# EAGLE design XBeeShield (EAGLE 5.11)
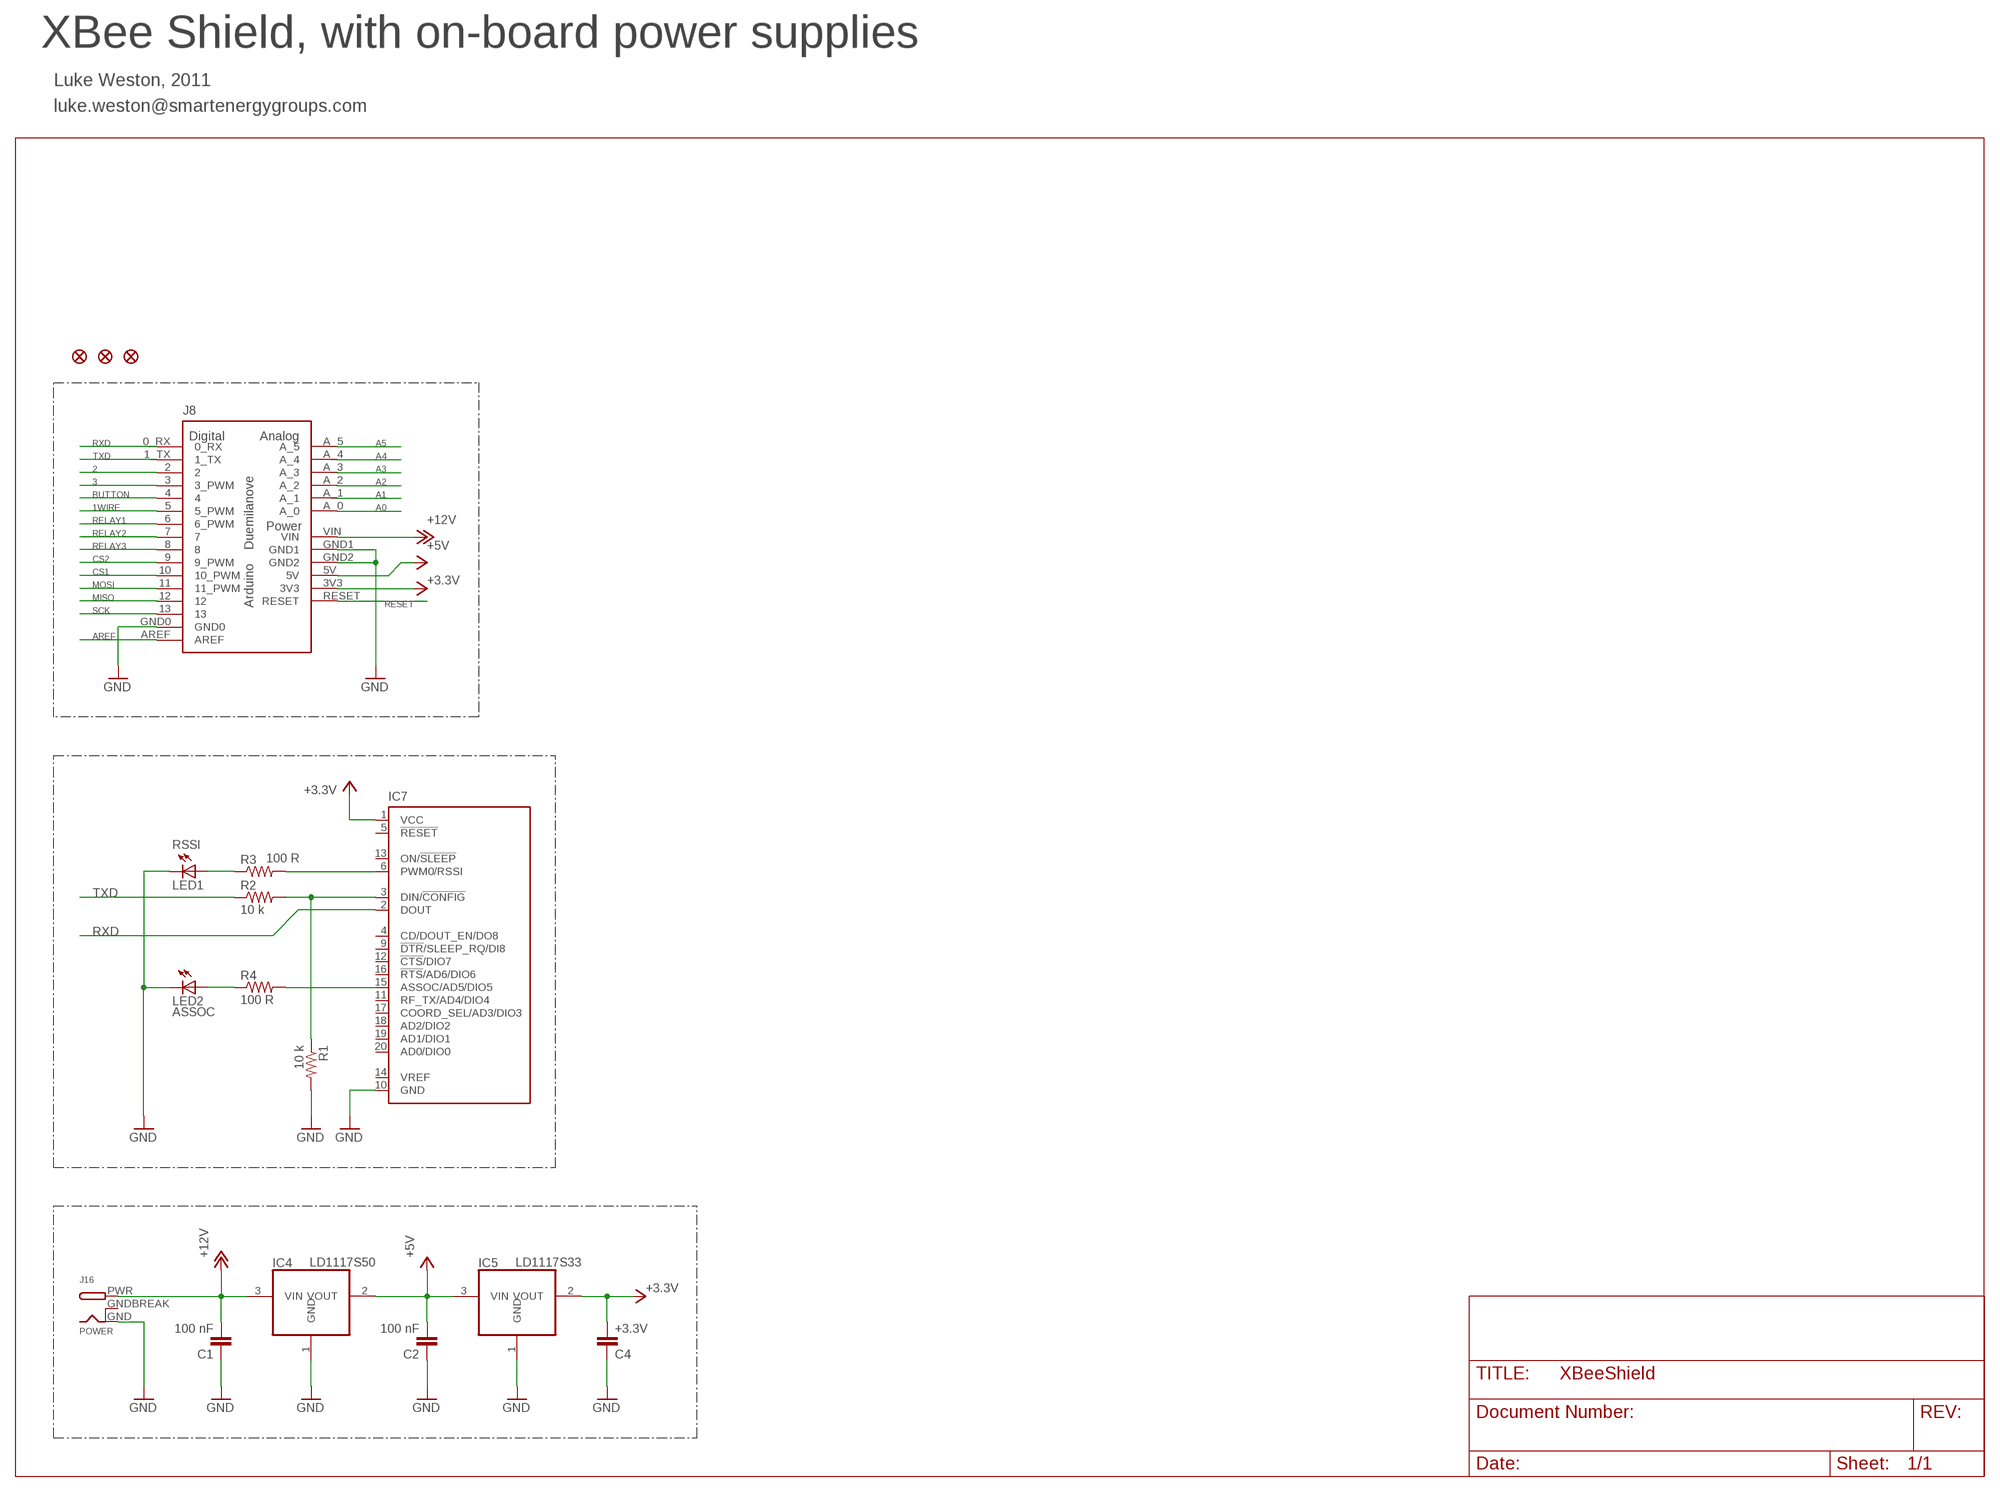
[diagram p0: schematic, sheet 1]

## Parts
C1  100 nF  C-EU050-024X044  [C050-024X044]
C2  100 nF  C-EU050-024X044  [C050-024X044]
C4  +3.3V  C-EU050-024X044  [C050-024X044]
IC4  LD1117S50  REG1117  [SOT223]
IC5  LD1117S33  REG1117  [SOT223]
IC7  XBEE-PRO  [XBEE-PRO]
J8  ARDUINO-USBNO-OUTLINE-NO-TEXT-OCTAGONAL  [NO-OUTLINE-OCTAGONAL-NOTEXT]
J16  POWER  DCBARRELPTH  [DCJACK_2MM_PTH]
JP2  FIDUCIAL1.5X3  [FIDUCIAL-1.5X3]
JP3  FIDUCIAL1.5X3  [FIDUCIAL-1.5X3]
JP4  FIDUCIAL1.5X3  [FIDUCIAL-1.5X3]
LED1  RSSI  LED3MM  [LED3MM]
LED2  ASSOC  LED3MM  [LED3MM]
R1  10 k  R-US_0207/10  [0207/10]
R2  10 k  R-US_0207/10  [0207/10]
R3  100 R  R-US_0207/10  [0207/10]
R4  100 R  R-US_0207/10  [0207/10]

## Nets
1WIRE: J8.5(5_PWM)
2: J8.2
3: J8.3(3_PWM)
+3.3V: C4.2 IC5.2(VOUT) IC7.1(VCC) J8.3V3
+5V: C2.2 IC4.2(VOUT) IC5.3(VIN) J8.5V
+12V: C1.2 IC4.3(VIN) J8.VIN J16.PWR
A0: J8.A_0
A1: J8.A_1
A2: J8.A_2
A3: J8.A_3
A4: J8.A_4
A5: J8.A_5
AREF: J8.AREF
BUTTON: J8.4
CS1: J8.10(10_PWM)
CS2: J8.9(9_PWM)
GND: C1.1 C2.1 C4.1 IC4.1(GND) IC5.1(GND) IC7.10(GND) J8.GND0 J8.GND1 J8.GND2 J16.GND LED1.K(C) LED2.K(C) R1.2
MISO: J8.12
MOSI: J8.11(11_PWM)
N$23: IC7.6(PWM0/RSSI) R3.2
N$25: IC7.3(DIN/!CONFIG) R1.1 R2.2
N$29: IC7.15(ASSOC/AD5/DIO5) R4.2
N$33: LED1.A R3.1
N$34: LED2.A R4.1
RELAY1: J8.6(6_PWM)
RELAY2: J8.7
RELAY3: J8.8
RESET: J8.RESET
RXD: IC7.2(DOUT) J8.0_RX
SCK: J8.13
TXD: J8.1_TX R2.1
Unconnected: IC7.4(CD/DOUT_EN/DO8) IC7.5(!RESET) IC7.9(!DTR!/SLEEP_RQ/DI8) IC7.11(RF_TX/AD4/DIO4) IC7.12(!CTS!/DIO7) IC7.13(ON/!SLEEP) IC7.14(VREF) IC7.16(!RTS!/AD6/DIO6) IC7.17(COORD_SEL/AD3/DIO3) IC7.18(AD2/DIO2) IC7.19(AD1/DIO1) IC7.20(AD0/DIO0)

## Notes on the sheet
- XBee Shield, with on-board power supplies
- Luke Weston, 2011
- luke.weston@smartenergygroups.com

## Power pins joined to a net without a drawn wire
GNDBREAK: J16.GNDBREAK

## Library data of the parts
C1 C2 C4 = rcl:C-EU: CAPACITOR, European symbol
IC4 IC5 = burr-brown:REG1117: 800mA and 1A Low Dropout (LDO) Positive Regulator 1.8V, 2.5V, 2.85V, 3.3V, 5V, and Adj; MPN: REG1117; OC_FARNELL: 1097566; OC_NEWARK: 14P6981
IC7 = maxstream:XBEE: XBee (TM) /XBee-PRO(TM) OEM RF Modules Source: MaxStream, Inc. xbee_productmanual.pdf; MPN: XBP24-AWI-001; OC_FARNELL: 1337916; OC_NEWARK: 42M2667
J8 = Arduino-Various:ARDUINO-USB: The Ardiuno Duemilanove Pinouts layoutet as a Bare Shield. v0.5 Also for Arduino Diecimila. This is designed as a Part and has no Outline in the Dimension Layer. The Outline, when present, is drawed at the tPlace / bPlace Layer. Library by Stephanie Lange, http://www.k-ita.de/~sl/
J16 = adafruit:DCBARREL: 2.0mm DC Barrel Jack DCJACK_2MM_PTH - Through Hole Jack (4UConnector: 05537)
JP2-JP4 = SparkFun:FIDUCIAL: Fiducial Alignment Points Various fiducial points for machine vision alignment.
LED1 LED2 = SparkFun:LED: LEDs Standard schematic elements and footprints for 5mm, 3mm, 1206, and 0603 sized LEDs. 5mm - Spark Fun Electronics SKU : COM-00529 (and others)
R1-R4 = rcl:R-US_: RESISTOR, American symbol

## Board
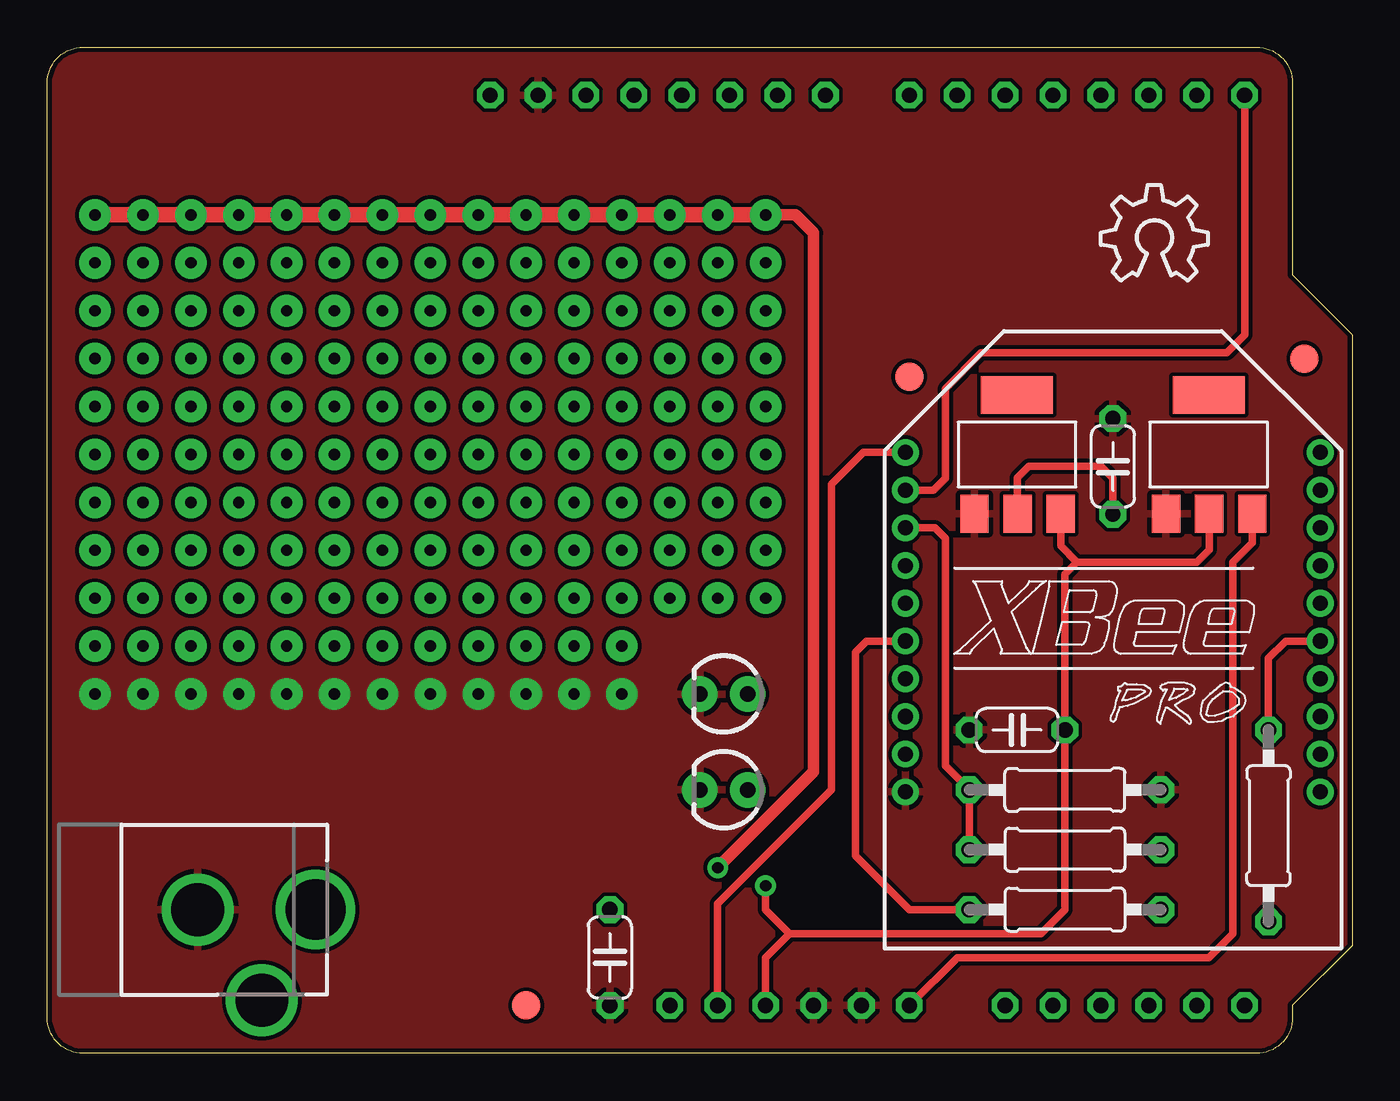
[diagram p1: board, top side]
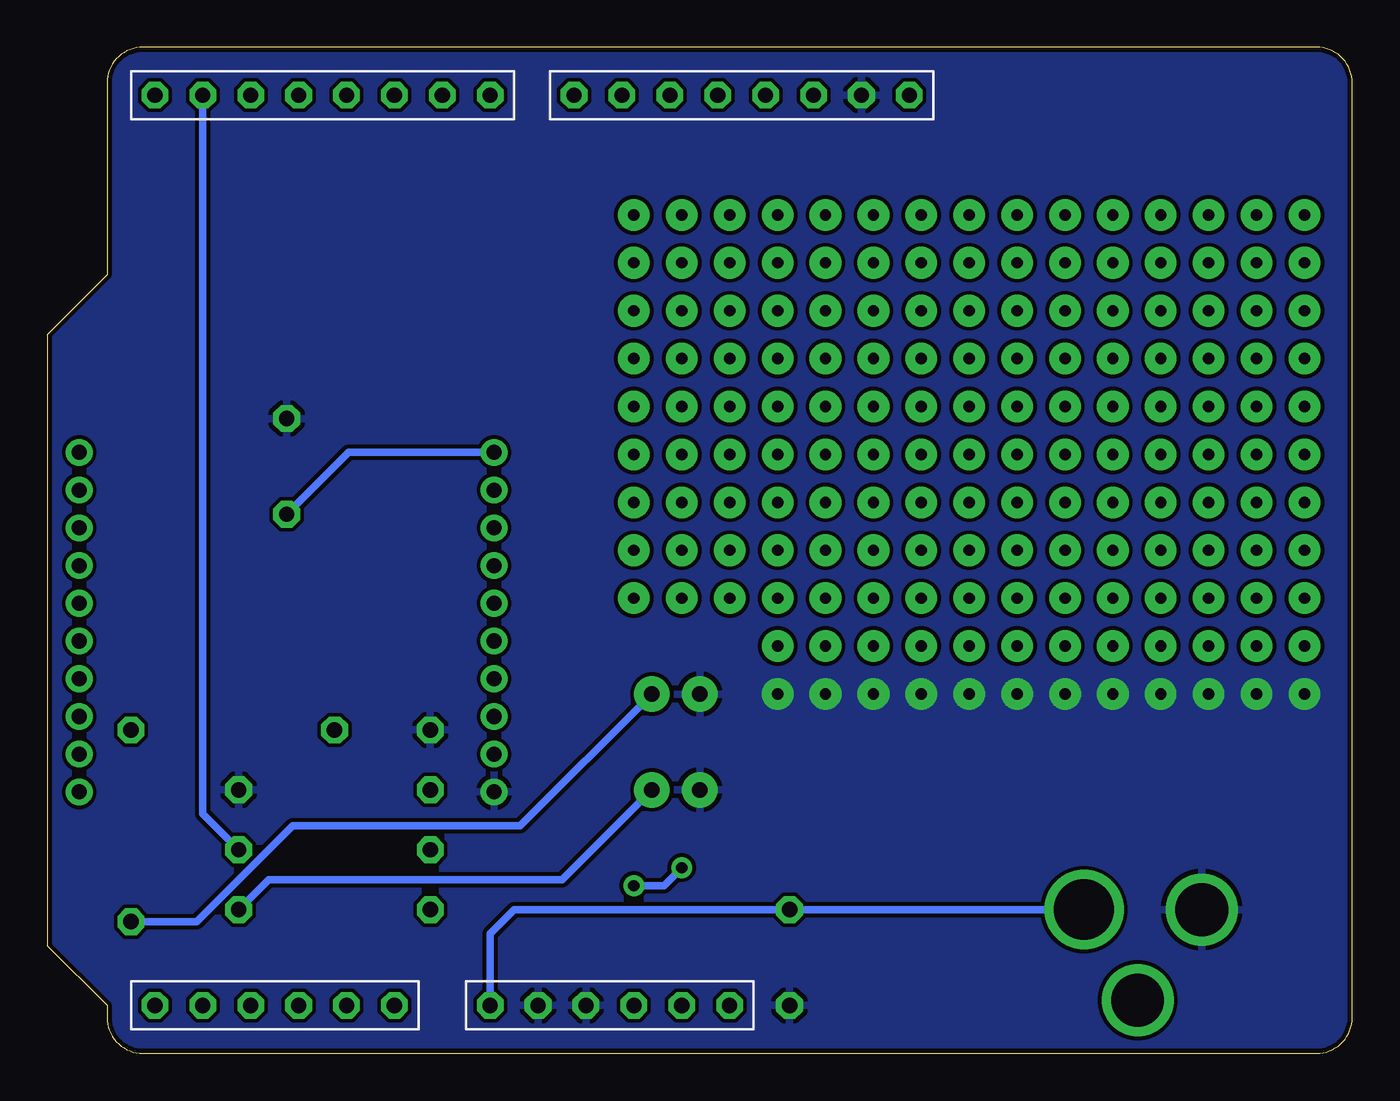
[diagram p2: board, bottom side, seen from below]

Size 69.22 x 53.34 mm. Coordinates in mm from the lower left corner, seen from the top.
Outline: 69.22,5.71 66.04,2.54 66.04,1.9 arc-90 64.14,0 1.91,0 arc-90 0,1.9 0,51.43 arc-90 1.91,53.34 64.14,53.34 arc-90 66.04,51.43 66.04,41.27 69.22,38.1 69.22,5.71
Copper layers (1*16): Top 0.035mm / dielectric 1.5mm / Bottom 0.035mm
Design rules "SparkFun.drc": minimum track width 8mil, minimum drill 20mil, track to track 8mil, track to pad 8mil, pad to pad 8mil, via to via 8mil, smd to smd 8mil, copper to edge 10mil, drill to drill 8mil, minimum pad ring 12mil, minimum via ring 10mil, stop-mask expansion 4mil, vias tented up to drill 25mil, thermal gap 10mil

### Footprints (pad centres in the part's own frame; a part is rotated, then mirrored left to right if it is on the bottom)
C050-024X044 = drill 0.813 octagon: 1 -2.54,0; 2 2.54,0
SOT223 = smd 1.499 x 2.007: 1 -2.261,-3.15; 2 0.025,-3.15; 3 2.311,-3.15 | smd 3.81 x 2.007: 4 0,3.15
XBEE-PRO = drill 0.8 pad 1.27 round: 1 -11,9; 2 -11,7; 3 -11,5; 4 -11,3; 5 -11,1; 6 -11,-1; 7 -11,-3; 8 -11,-5; 9 -11,-7; 10 -11,-9; 11 11,-9; 12 11,-7; 13 11,-5; 14 11,-3; 15 11,-1; 16 11,1; 17 11,3; 18 11,5; 19 11,7; 20 11,9
NO-OUTLINE-OCTAGONAL-NOTEXT = drill 0.8 pad 1.27 octagon: 0_RX -25.4,27.94; 1_TX -25.4,25.4; 2 -25.4,22.86; 3 -25.4,20.32; 3V3 22.86,0; 4 -25.4,17.78; 5 -25.4,15.24; 5V 22.86,2.54; 6 -25.4,12.7; 7 -25.4,10.16; 8 -25.4,5.715; 9 -25.4,3.175; 10 -25.4,0.635; 11 -25.4,-1.905; 12 -25.4,-4.445; 13 -25.4,-6.985; A_0 22.86,15.24; A_1 22.86,17.78; A_2 22.86,20.32; A_3 22.86,22.86; A_4 22.86,25.4; A_5 22.86,27.94; AREF -25.4,-12.065; GND0 -25.4,-9.525; GND1 22.86,7.62; GND2 22.86,5.08; RESET 22.86,-2.54; VIN 22.86,10.16
DCJACK_2MM_PTH = drill 2.8 round: GND 0,7.35; GNDBREAK 4.8,10.75 | drill 3.2 round: PWR 0,13.6
FIDUCIAL-1.5X3 = smd 1.5 x 1.5: 1 0,0
LED3MM = drill 0.813 pad 1.88 round: A -1.27,0; K 1.27,0
0207/10 = drill 0.813 octagon: 1 -5.08,0; 2 5.08,0

### Placement (x,y rotation side)
C1  29.84,5.08 90 top
C2  51.44,17.14 0 top
C4  56.52,31.11 270 top
IC4  61.59,31.75 0 top
IC5  51.44,31.75 0 top
IC7  56.52,22.86 0 top
J8  35.56,25.4 270 top
J16  0.63,7.62 270 top
JP2  66.67,36.83 180 top
JP3  45.72,35.88 180 top
JP4  25.4,2.54 180 top
LED1  35.88,13.97 180 top
LED2  35.88,19.05 180 top
R1  53.98,13.97 0 top
R2  53.98,10.79 180 top
R3  53.98,7.62 180 top
R4  64.77,12.06 90 top
U$1  [OSHW_8X200_NOTEXT]  55.88,40.96 0 top

### Tracks (layer width: path | path; a pad name or v marks a point on that pad's centre or on a via)
+3.3V
  Top 0.406: 51.44,28.63 IC5.2 51.46,30.5 52.07,31.11 55.88,31.11 56.52,30.48 C4.2 | J8.3V3 35.56,7.94 41.59,13.97 41.59,30.16 43.29,31.86 IC7.1
  Bottom 0.406: IC7.1 53.23,31.86 C4.2
+5V  (via drill 0.6, 0.6 pad 1.68)
  Top 0.406: 61.59,28.63 IC4.2 61.62,26.7 60.96,26.04 54.61,26.04 | IC5.3 53.75,26.9 54.61,26.04 | 54.61,26.04 53.98,25.4 C2.2 53.98,7.62 52.7,6.35 39.37,6.35 | J8.5V 38.1,5.08 39.37,6.35 | 39.37,6.35 38.1,7.62 v38.1,8.89
  Top 0.61: v38.1,44.45 39.69,44.45 40.64,43.5 40.64,14.92 v35.56,9.84
  Top 0.813: v2.54,44.45 v5.08,44.45 v7.62,44.45 v10.16,44.45 v12.7,44.45 v15.24,44.45 v17.78,44.45 v20.32,44.45 v22.86,44.45 v25.4,44.45 v27.94,44.45 v30.48,44.45 v33.02,44.45 v35.56,44.45 v38.1,44.45
  Bottom 0.406: v38.1,8.89 36.51,8.89 v35.56,9.84
+12V
  Top 0.406: IC4.3 63.91,27.08 62.86,26.04 62.86,6.35 61.59,5.08 48.26,5.08 J8.VIN
  Bottom 0.406: J8.VIN 45.72,6.35 44.45,7.62 C1.2 J16.PWR
GND  (via drill 0.6 pad 1.68)
  other vias: 2.54,19.05 7.62,19.05 5.08,19.05 10.16,19.05 12.7,19.05 15.24,19.05 17.78,19.05 20.32,19.05 22.86,19.05 25.4,19.05 27.94,19.05 30.48,19.05
  pour Top: 74.93,-3.17 -4.45,-3.17 -4.45,57.78 74.93,57.78
  pour Bottom: 73.03,-1.91 -2.54,-1.91 -2.54,55.88 73.03,55.88
N$1  (via drill 0.6 pad 1.68)
  other vias: 2.54,41.91
N$2  (via drill 0.6 pad 1.68)
  other vias: 2.54,26.67
N$3  (via drill 0.6 pad 1.68)
  other vias: 5.08,26.67
N$4  (via drill 0.6 pad 1.68)
  other vias: 2.54,29.21
N$5  (via drill 0.6 pad 1.68)
  other vias: 2.54,31.75
N$6  (via drill 0.6 pad 1.68)
  other vias: 2.54,34.29
N$7  (via drill 0.6 pad 1.68)
  other vias: 2.54,36.83
N$8  (via drill 0.6 pad 1.68)
  other vias: 2.54,39.37
N$9  (via drill 0.6 pad 1.68)
  other vias: 5.08,41.91
N$10  (via drill 0.6 pad 1.68)
  other vias: 7.62,41.91
N$11  (via drill 0.6 pad 1.68)
  other vias: 10.16,41.91
N$12  (via drill 0.6 pad 1.68)
  other vias: 12.7,41.91
N$13  (via drill 0.6 pad 1.68)
  other vias: 15.24,41.91
N$14  (via drill 0.6 pad 1.68)
  other vias: 17.78,41.91
N$15  (via drill 0.6 pad 1.68)
  other vias: 7.62,26.67
N$16  (via drill 0.6 pad 1.68)
  other vias: 35.56,26.67
N$17  (via drill 0.6 pad 1.68)
  other vias: 38.1,26.67
N$18  (via drill 0.6 pad 1.68)
  other vias: 38.1,29.21
N$19  (via drill 0.6 pad 1.68)
  other vias: 38.1,31.75
N$20  (via drill 0.6 pad 1.68)
  other vias: 38.1,34.29
N$21  (via drill 0.6 pad 1.68)
  other vias: 12.7,39.37
N$22  (via drill 0.6 pad 1.68)
  other vias: 12.7,36.83
N$23
  Top 0.406: IC7.6 43.45,21.86 42.86,21.27 42.86,10.48 45.72,7.62 R3.2
N$24  (via drill 0.6 pad 1.68)
  other vias: 12.7,34.29
N$25
  Top 0.406: R2.2 R1.1 47.62,15.24 47.62,27.3 47.07,27.86 IC7.3
N$26  (via drill 0.6 pad 1.68)
  other vias: 12.7,31.75
N$27  (via drill 0.6 pad 1.68)
  other vias: 38.1,41.91
N$28  (via drill 0.6 pad 1.68)
  other vias: 38.1,39.37
N$29
  Top 0.406: IC7.15 65.67,21.86 64.77,20.96 R4.2
N$31  (via drill 0.6 pad 1.68)
  other vias: 38.1,36.83
N$32  (via drill 0.6 pad 1.68)
  other vias: 20.32,41.91
N$33
  Bottom 0.406: R3.1 57.47,9.21 41.91,9.21 LED1.A
N$34
  Bottom 0.406: LED2.A 44.13,12.06 56.2,12.06 61.28,6.98 R4.1
N$35  (via drill 0.6 pad 1.68)
  other vias: 22.86,41.91
N$36  (via drill 0.6 pad 1.68)
  other vias: 25.4,41.91
N$37  (via drill 0.6 pad 1.68)
  other vias: 27.94,41.91
N$38  (via drill 0.6 pad 1.68)
  other vias: 30.48,41.91
N$39  (via drill 0.6 pad 1.68)
  other vias: 33.02,41.91
N$40  (via drill 0.6 pad 1.68)
  other vias: 35.56,41.91
N$41  (via drill 0.6 pad 1.68)
  other vias: 35.56,39.37
N$42  (via drill 0.6 pad 1.68)
  other vias: 35.56,36.83
N$43  (via drill 0.6 pad 1.68)
  other vias: 35.56,34.29
N$44  (via drill 0.6 pad 1.68)
  other vias: 35.56,31.75
N$45  (via drill 0.6 pad 1.68)
  other vias: 35.56,29.21
N$46  (via drill 0.6 pad 1.68)
  other vias: 33.02,26.67
N$47  (via drill 0.6 pad 1.68)
  other vias: 30.48,26.67
N$48  (via drill 0.6 pad 1.68)
  other vias: 27.94,26.67
N$49  (via drill 0.6 pad 1.68)
  other vias: 25.4,26.67
N$50  (via drill 0.6 pad 1.68)
  other vias: 22.86,26.67
N$51  (via drill 0.6 pad 1.68)
  other vias: 20.32,26.67
N$52  (via drill 0.6 pad 1.68)
  other vias: 20.32,29.21
N$53  (via drill 0.6 pad 1.68)
  other vias: 17.78,29.21
N$54  (via drill 0.6 pad 1.68)
  other vias: 15.24,29.21
N$55  (via drill 0.6 pad 1.68)
  other vias: 15.24,26.67
N$56  (via drill 0.6 pad 1.68)
  other vias: 12.7,26.67
N$57  (via drill 0.6 pad 1.68)
  other vias: 10.16,26.67
N$58  (via drill 0.6 pad 1.68)
  other vias: 17.78,26.67
N$59  (via drill 0.6 pad 1.68)
  other vias: 5.08,29.21
N$60  (via drill 0.6 pad 1.68)
  other vias: 7.62,29.21
N$61  (via drill 0.6 pad 1.68)
  other vias: 10.16,29.21
N$62  (via drill 0.6 pad 1.68)
  other vias: 12.7,29.21
N$63  (via drill 0.6 pad 1.68)
  other vias: 22.86,29.21
N$64  (via drill 0.6 pad 1.68)
  other vias: 25.4,29.21
N$65  (via drill 0.6 pad 1.68)
  other vias: 27.94,29.21
N$66  (via drill 0.6 pad 1.68)
  other vias: 30.48,29.21
N$67  (via drill 0.6 pad 1.68)
  other vias: 33.02,29.21
N$68  (via drill 0.6 pad 1.68)
  other vias: 5.08,39.37
N$69  (via drill 0.6 pad 1.68)
  other vias: 5.08,36.83
N$70  (via drill 0.6 pad 1.68)
  other vias: 5.08,34.29
N$71  (via drill 0.6 pad 1.68)
  other vias: 5.08,31.75
N$72  (via drill 0.6 pad 1.68)
  other vias: 7.62,31.75
N$73  (via drill 0.6 pad 1.68)
  other vias: 7.62,34.29
N$74  (via drill 0.6 pad 1.68)
  other vias: 7.62,36.83
N$75  (via drill 0.6 pad 1.68)
  other vias: 7.62,39.37
N$76  (via drill 0.6 pad 1.68)
  other vias: 10.16,39.37
N$77  (via drill 0.6 pad 1.68)
  other vias: 10.16,36.83
N$78  (via drill 0.6 pad 1.68)
  other vias: 10.16,34.29
N$79  (via drill 0.6 pad 1.68)
  other vias: 10.16,31.75
N$80  (via drill 0.6 pad 1.68)
  other vias: 15.24,31.75
N$81  (via drill 0.6 pad 1.68)
  other vias: 15.24,34.29
N$82  (via drill 0.6 pad 1.68)
  other vias: 15.24,36.83
N$83  (via drill 0.6 pad 1.68)
  other vias: 15.24,39.37
N$84  (via drill 0.6 pad 1.68)
  other vias: 17.78,39.37
N$85  (via drill 0.6 pad 1.68)
  other vias: 17.78,36.83
N$86  (via drill 0.6 pad 1.68)
  other vias: 17.78,34.29
N$87  (via drill 0.6 pad 1.68)
  other vias: 17.78,31.75
N$88  (via drill 0.6 pad 1.68)
  other vias: 20.32,31.75
N$89  (via drill 0.6 pad 1.68)
  other vias: 20.32,34.29
N$90  (via drill 0.6 pad 1.68)
  other vias: 20.32,36.83
N$91  (via drill 0.6 pad 1.68)
  other vias: 20.32,39.37
N$92  (via drill 0.6 pad 1.68)
  other vias: 22.86,39.37
N$93  (via drill 0.6 pad 1.68)
  other vias: 22.86,36.83
N$94  (via drill 0.6 pad 1.68)
  other vias: 22.86,34.29
N$95  (via drill 0.6 pad 1.68)
  other vias: 22.86,31.75
N$96  (via drill 0.6 pad 1.68)
  other vias: 25.4,31.75
N$97  (via drill 0.6 pad 1.68)
  other vias: 25.4,34.29
N$98  (via drill 0.6 pad 1.68)
  other vias: 25.4,36.83
N$99  (via drill 0.6 pad 1.68)
  other vias: 25.4,39.37
N$100  (via drill 0.6 pad 1.68)
  other vias: 27.94,39.37
N$101  (via drill 0.6 pad 1.68)
  other vias: 30.48,36.83
N$102  (via drill 0.6 pad 1.68)
  other vias: 30.48,39.37
N$103  (via drill 0.6 pad 1.68)
  other vias: 33.02,39.37
N$104  (via drill 0.6 pad 1.68)
  other vias: 33.02,36.83
N$105  (via drill 0.6 pad 1.68)
  other vias: 33.02,34.29
N$106  (via drill 0.6 pad 1.68)
  other vias: 33.02,31.75
N$107  (via drill 0.6 pad 1.68)
  other vias: 30.48,31.75
N$108  (via drill 0.6 pad 1.68)
  other vias: 30.48,34.29
N$109  (via drill 0.6 pad 1.68)
  other vias: 27.94,34.29
N$110  (via drill 0.6 pad 1.68)
  other vias: 27.94,36.83
N$111  (via drill 0.6 pad 1.68)
  other vias: 27.94,31.75
N$113  (via drill 0.6 pad 1.68)
  other vias: 2.54,24.13
N$114  (via drill 0.6 pad 1.68)
  other vias: 2.54,21.59
N$118  (via drill 0.6 pad 1.68)
  other vias: 33.02,24.13
N$121  (via drill 0.6 pad 1.68)
  other vias: 35.56,24.13
N$122  (via drill 0.6 pad 1.68)
  other vias: 38.1,24.13
N$133  (via drill 0.6 pad 1.68)
  other vias: 27.94,21.59
N$134  (via drill 0.6 pad 1.68)
  other vias: 30.48,21.59
N$137  (via drill 0.6 pad 1.68)
  other vias: 30.48,24.13
N$138  (via drill 0.6 pad 1.68)
  other vias: 27.94,24.13
N$141  (via drill 0.6 pad 1.68)
  other vias: 25.4,24.13
N$142  (via drill 0.6 pad 1.68)
  other vias: 25.4,21.59
N$146  (via drill 0.6 pad 1.68)
  other vias: 20.32,21.59
N$147  (via drill 0.6 pad 1.68)
  other vias: 20.32,24.13
N$148  (via drill 0.6 pad 1.68)
  other vias: 22.86,24.13
N$149  (via drill 0.6 pad 1.68)
  other vias: 22.86,21.59
N$150  (via drill 0.6 pad 1.68)
  other vias: 17.78,21.59
N$151  (via drill 0.6 pad 1.68)
  other vias: 17.78,24.13
N$158  (via drill 0.6 pad 1.68)
  other vias: 5.08,21.59
N$159  (via drill 0.6 pad 1.68)
  other vias: 5.08,24.13
N$160  (via drill 0.6 pad 1.68)
  other vias: 7.62,24.13
N$161  (via drill 0.6 pad 1.68)
  other vias: 7.62,21.59
N$162  (via drill 0.6 pad 1.68)
  other vias: 10.16,21.59
N$163  (via drill 0.6 pad 1.68)
  other vias: 10.16,24.13
N$164  (via drill 0.6 pad 1.68)
  other vias: 12.7,24.13
N$165  (via drill 0.6 pad 1.68)
  other vias: 12.7,21.59
N$166  (via drill 0.6 pad 1.68)
  other vias: 15.24,21.59
N$167  (via drill 0.6 pad 1.68)
  other vias: 15.24,24.13
RXD
  Top 0.406: IC7.2 47.01,29.86 47.62,30.48 47.62,35.24 49.53,37.15 62.55,37.15 63.5,38.1 J8.0_RX
TXD
  Bottom 0.406: J8.1_TX 60.96,12.7 R2.1

### Text on the board
Document: SHIELD POWER SUPPLY NOT REQUIRED IF USED WITH A STANDARD ARDUINO. | 100n | ASSOCIATE | THE LD1117S33 REGULATOR OUTPUTS 3.3V | AND THE LD1117S50 REGULATOR OUTPUTS 5 V. | RSSI | DO NOT MIX THEM UP WHEN ASSEMBLING THE BOARD. | 100 nF
Reference: AREF | GND | 13 | 12 | 11 | 10 | 9 | 8 | 7 | 6 | 5 | 4 | 3 | 2 | 1 | 0 | +5V | Open Hardware | GND | XBee Arduino Shield | GROUND | Includes voltage regulators (works with Arduino Pro) | Luke Weston, 2011 | A0 | A1 | A2 | A3 | A4 | A5 | RST | +3.3 | +5V | GND | GND